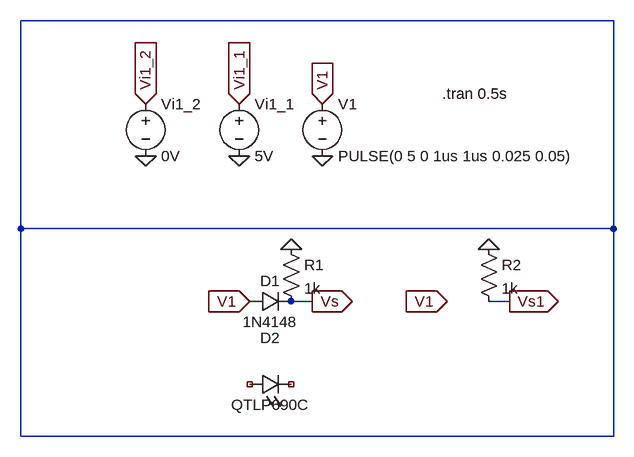
[diagram p0: schematic Draft1.asc]
Draft1.asc, the LTspice schematic file:
Version 4
SHEET 1 880 680
WIRE 496 -64 -416 -64
WIRE -416 256 -416 -64
WIRE 496 256 496 -64
WIRE 496 256 -416 256
WIRE 32 368 0 368
WIRE 336 368 304 368
WIRE -416 576 -416 256
WIRE 496 576 496 256
WIRE 496 576 -416 576
FLAG 48 144 0
FLAG 48 64 V1
IOPIN 48 64 In
FLAG -224 144 0
FLAG -80 144 0
FLAG -80 64 Vi1_1
IOPIN -80 64 In
FLAG -224 64 Vi1_2
IOPIN -224 64 In
FLAG 32 368 Vs
IOPIN 32 368 Out
FLAG -64 368 V1
IOPIN -64 368 In
FLAG 0 288 0
FLAG 336 368 Vs1
IOPIN 336 368 Out
FLAG 240 368 V1
IOPIN 240 368 In
FLAG 304 288 0
SYMBOL voltage 48 48 R0
WINDOW 123 0 0 Left 0
WINDOW 39 0 0 Left 0
SYMATTR InstName V1
SYMATTR Value PULSE(0 5 0 1us 1us 0.025 0.05)
SYMBOL voltage -224 48 R0
WINDOW 123 0 0 Left 0
WINDOW 39 0 0 Left 0
SYMATTR InstName Vi1_2
SYMATTR Value 0V
SYMBOL voltage -80 48 R0
WINDOW 123 0 0 Left 0
WINDOW 39 0 0 Left 0
SYMATTR InstName Vi1_1
SYMATTR Value 5V
SYMBOL diode -64 384 R270
WINDOW 0 32 32 VTop 2
WINDOW 3 0 32 VBottom 2
SYMATTR InstName D1
SYMATTR Value 1N4148
SYMBOL res -16 272 R0
SYMATTR InstName R1
SYMATTR Value 1k
SYMBOL LED -64 512 R270
WINDOW 0 72 32 VTop 2
WINDOW 3 0 32 VBottom 2
SYMATTR InstName D2
SYMATTR Value QTLP690C
SYMATTR Description Diode
SYMATTR Type diode
SYMBOL res 288 272 R0
SYMATTR InstName R2
SYMATTR Value 1k
TEXT 232 48 Left 2 !.tran 0.5s

The netlist it stands for:
* Draft1.asc
V1 V1 0 PULSE(0 5 0 1us 1us 0.025 0.05)
Vi1_2 Vi1_2 0 0V
Vi1_1 Vi1_1 0 5V
D1 V1 Vs 1N4148
R1 0 Vs 1k
D2 NC_01 NC_02 QTLP690C
R2 0 Vs1 1k
.model D D
.lib standard.dio
.tran 0.5s
.backanno
.end

* Results of the author's LTspice run, read from the files saved beside the schematic
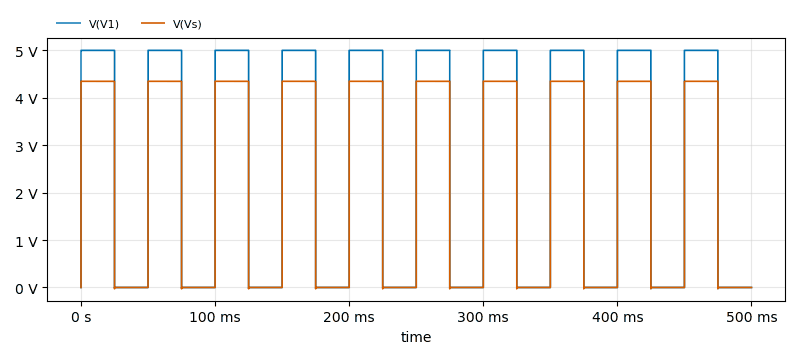
[diagram p1: Transient Analysis of Draft1.asc, plotted from the saved traces]
* Transient Analysis, 1 run:
*   V(V1): min 0 V, max 5 V, average 2.5 V, rms 3.536 V, last 0 V
*   V(Vs): min -28.06 mV, max 4.348 V, average 2.174 V, rms 3.074 V, last 0 V